# Altium schematic sheet foc.SchDoc
size A3; SheetNumber: 1; SheetTotal: 1
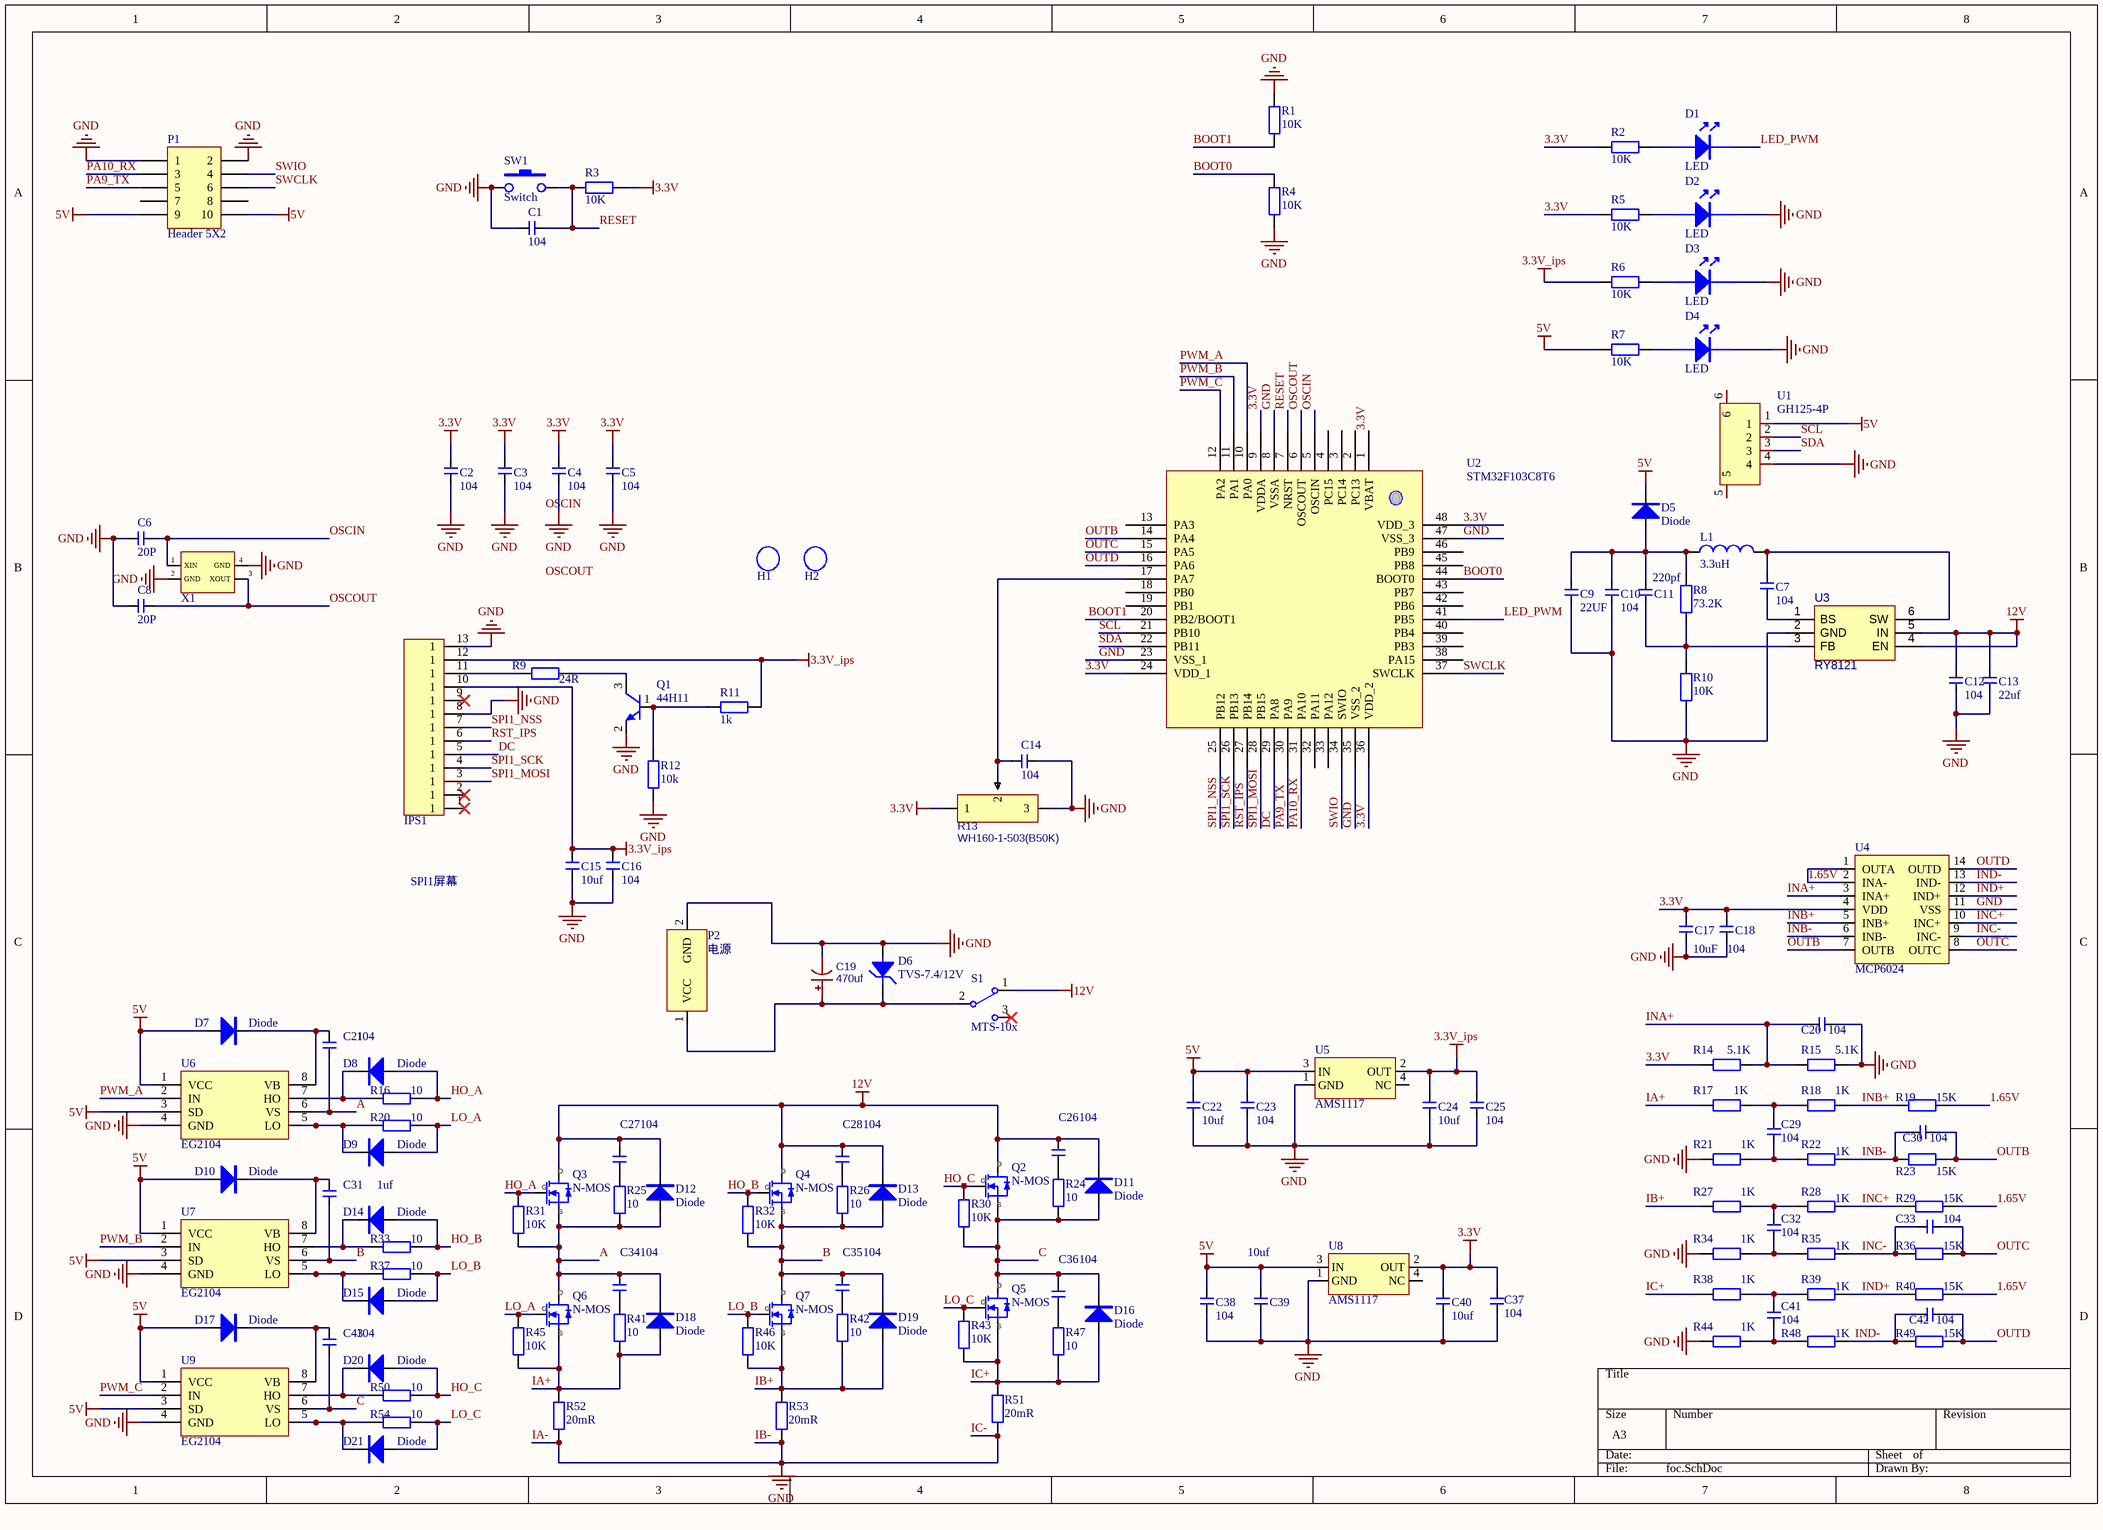
[diagram p0: foc.SchDoc]

## Parts
C1  104  [C0603]
C2  104  [C0603]
C3  104  [C0603]
C4  104  [C0603]
C5  104  [C0603]
C6  20P  [C0603]
C7  104  [C0603]
C8  20P  [C0603]
C9  22UF  [C0603]
C10  104  [C0603]
C11  220pf  [C0603]
C12  104  [C0603]
C13  22uf  [C0603]
C14  104  [C0603]
C15  10uf  [C0603]
C16  104  [C0603]
C17  10uF  [C0603]
C18  104  [C0603]
C19  470uf  [CAP-SMD_BD6.3-L6.6-W6.6-LS7.2-R-RD]
C20  104  [C0603]
C21  104  [C0603]
C22  10uf  [C0603]
C23  104  [C0603]
C24  10uf  [C0603]
C25  104  [C0603]
C26  104  [C0603]
C27  104  [C0603]
C28  104  [C0603]
C29  104  [C0603]
C30  104  [C0603]
C31  1uf  [C0603]
C32  104  [C0603]
C33  104  [C0603]
C34  104  [C0603]
C35  104  [C0603]
C36  104  [C0603]
C37  104  [C0603]
C38  104  [C0603]
C39  10uf  [C0603]
C40  10uf  [C0603]
C41  104  [C0603]
C42  104  [C0603]
C43  104  [C0603]
D1  LED  [LED0603]
D2  LED  [LED0603]
D3  LED  [LED0603]
D4  LED  [LED0603]
D5  Diode  [SOD-123FL_L2.7-W1.8-LS3.8-RD]
D6  TVS-7.4/12V  [SMA]
D7  Diode  [SOD-123FL_L2.7-W1.8-LS3.8-RD]
D8  Diode  [ESC_L1.2-W0.8-LS1.6-RD]
D9  Diode  [ESC_L1.2-W0.8-LS1.6-RD]
D10  Diode  [SOD-123FL_L2.7-W1.8-LS3.8-RD]
D11  Diode  [SOD-123FL_L2.7-W1.8-LS3.8-RD]
D12  Diode  [SOD-123FL_L2.7-W1.8-LS3.8-RD]
D13  Diode  [SOD-123FL_L2.7-W1.8-LS3.8-RD]
D14  Diode  [ESC_L1.2-W0.8-LS1.6-RD]
D15  Diode  [ESC_L1.2-W0.8-LS1.6-RD]
D16  Diode  [SOD-123FL_L2.7-W1.8-LS3.8-RD]
D17  Diode  [SOD-123FL_L2.7-W1.8-LS3.8-RD]
D18  Diode  [SOD-123FL_L2.7-W1.8-LS3.8-RD]
D19  Diode  [SOD-123FL_L2.7-W1.8-LS3.8-RD]
D20  Diode  [ESC_L1.2-W0.8-LS1.6-RD]
D21  Diode  [ESC_L1.2-W0.8-LS1.6-RD]
H1  Hole  [铜柱孔3]  (value not drawn)
H2  Hole  [铜柱孔3]  (value not drawn)
IPS1  IPS1.14  [IPS]  (value not drawn)
L1  3.3uH  [0402 TPC 4*4*2]
P1  Header 5X2  [HDR2X5]
P2  电源  [POWER]
Q1  44H11  [SOT-23-3_L2.9-W1.3-P1.90-LS2.4-BR]
Q2  N-MOS  [TDSON-8]
Q3  N-MOS  [TDSON-8]
Q4  N-MOS  [TDSON-8]
Q5  N-MOS  [TDSON-8]
Q6  N-MOS  [TDSON-8]
Q7  N-MOS  [TDSON-8]
R1  10K  [R0603]
R2  10K  [R0603]
R3  10K  [R0603]
R4  10K  [R0603]
R5  10K  [R0603]
R6  10K  [R0603]
R7  10K  [R0603]
R8  73.2K  [R0603]
R9  24R  [R0603]
R10  10K  [R0603]
R11  1k  [R0603]
R12  10k  [R0603]
R13  WH160-1-503(B50K)  [滑动变阻器]
R14  5.1K  [R0603]
R15  5.1K  [R0603]
R16  10  [R0603]
R17  1K  [R0603]
R18  1K  [R0603]
R19  15K  [R0603]
R20  10  [R0603]
R21  1K  [R0603]
R22  1K  [R0603]
R23  15K  [R0603]
R24  10  [R0603]
R25  10  [R0603]
R26  10  [R0603]
R27  1K  [R0603]
R28  1K  [R0603]
R29  15K  [R0603]
R30  10K  [R0603]
R31  10K  [R0603]
R32  10K  [R0603]
R33  10  [R0603]
R34  1K  [R0603]
R35  1K  [R0603]
R36  15K  [R0603]
R37  10  [R0603]
R38  1K  [R0603]
R39  1K  [R0603]
R40  15K  [R0603]
R41  10  [R0603]
R42  10  [R0603]
R43  10K  [R0603]
R44  1K  [R0603]
R45  10K  [R0603]
R46  10K  [R0603]
R47  10  [R0603]
R48  1K  [R0603]
R49  15K  [R0603]
R50  10  [R0603]
R51  20mR  [R1206]
R52  20mR  [R1206]
R53  20mR  [R1206]
R54  10  [R0603]
S1  MTS-10x  [SW-TH_HOOYA_SS-12D10G4]
SW1  Switch  [SW-SMD_L4.0-W2.9-LS5.0]
U1  GH125-4P  [CONN-SMD_4P-P1.27_GH125-S04DCA-00]
U2  STM32F103C8T6  [48P]
U3  RY8121  [SOT-23-6]
U4  MCP6024  [SOP14_L]
U5  AMS1117  [SOT-89_L4.5-W2.5-P1.50-LS4.2-BR]
U6  EG2104  [SOP-8]
U7  EG2104  [SOP-8]
U8  AMS1117  [SOT-89_L4.5-W2.5-P1.50-LS4.2-BR]
U9  EG2104  [SOP-8]
X1  XTAL-4  [OSC-SMD_4P-L3.2-W2.5-BL]  (value not drawn)

## Nets
3.3V: C2.2 C3.2 C4.2 C5.2 C17.1 C18.1 C37.2 C40.2 R2.1 R3.1 R5.1 R13.1 R14.2 U2.1(VBAT) U2.9(VDDA) U2.24(VDD_1) U2.36(VDD_2) U2.48(VDD_3) U4.4(VDD) U8.2(OUT)
3.3V_ips: C15.2 C16.2 C24.2 C25.2 IPS1.10(1) IPS1.12(1) R6.1 R11.1 U5.2(OUT)
5V: C22.2 C23.2 C38.2 C39.2 D5.1 D7.2 D10.2 D17.2 P1.9 P1.10 R7.1 U1.1 U5.3(IN) U6.1(VCC) U6.3(SD) U7.1(VCC) U7.3(SD) U8.3(IN) U9.1(VCC) U9.3(SD)
12V: C12.2 C13.2 C26.2 C27.2 C28.2 D11.1 D12.1 D13.1 Q2.1(D) Q3.1(D) Q4.1(D) S1.1 U3.4(EN) U3.5(IN)
GND: C1.2 C2.1 C3.1 C4.1 C5.1 C6.2 C8.2 C9.1 C10.1 C12.1 C13.1 C14.1 C15.1 C16.1 C17.2 C18.2 C19.2 C20.1 C22.1 C23.1 C24.1 C25.1 C37.1 C38.1 C39.1 C40.1 D2.N D3.N D4.N D6.A IPS1.8(1) IPS1.13(1) P1.1 P1.2 P2.2(GND) Q1.2(E) R1.1 R4.2 R10.1 R12.2 R13.3 R15.1 R21.2 R34.2 R44.2 R51.1 R52.1 R53.1 SW1.1 U1.4 U2.8(VSSA) U2.23(VSS_1) U2.35(VSS_2) U2.47(VSS_3) U3.2(GND) U4.11(VSS) U5.1(GND) U6.4(GND) U7.4(GND) U8.1(GND) U9.4(GND) X1.2(GND) X1.4(GND)  [also labelled IA-, IB-, IC-]
1.65V: R19.1 R29.1 R40.1 U4.1(OUTA) U4.2(INA-)
A: C21.1 C34.2 D12.2 D18.1 Q3.3(S) Q6.1(D) R25.2 R31.1 U6.6(VS)
B: C31.1 C35.2 D13.2 D19.1 Q4.3(S) Q7.1(D) R26.2 R32.1 U7.6(VS)
BOOT0: R4.1 U2.44(BOOT0)
BOOT1: R1.2 U2.20(PB2/BOOT1)
C: C36.2 C43.1 D11.2 D16.1 Q2.3(S) Q5.1(D) R24.2 R30.1 U9.6(VS)
DC: IPS1.5(1) U2.29(PA8)
HO_A: D8.2 Q3.2(G) R16.1 R31.2
HO_B: D14.2 Q4.2(G) R32.2 R33.1
HO_C: D20.2 Q2.2(G) R30.2 R50.1
IA+: D18.2 Q6.3(S) R17.2 R41.2 R45.1 R52.2
IB+: D19.2 Q7.3(S) R27.2 R42.2 R46.1 R53.2
IC+: D16.2 Q5.3(S) R38.2 R43.1 R47.2 R51.2
INA+: C20.2 R14.1 R15.2 U4.3(INA+)
INB+: R18.1 R19.2 U4.5(INB+)
INB-: C30.2 R22.1 R23.2 U4.6(INB-)
INC+: R28.1 R29.2 U4.10(INC+)
INC-: C33.2 R35.1 R36.2 U4.9(INC-)
IND+: R39.1 R40.2 U4.12(IND+)
IND-: C42.2 R48.1 R49.2 U4.13(IND-)
LED_PWM: D1.N U2.41(PB5)
LO_A: D9.2 Q6.2(G) R20.1 R45.2
LO_B: D15.2 Q7.2(G) R37.1 R46.2
LO_C: D21.2 Q5.2(G) R43.2 R54.1
OSCIN: C6.1 U2.5(OSCIN) X1.1(XIN)
OSCOUT: C8.1 U2.6(OSCOUT) X1.3(XOUT)
OUTB: C30.1 R23.1 U2.14(PA4) U4.7(OUTB)
OUTC: C33.1 R36.1 U2.15(PA5) U4.8(OUTC)
OUTD: C42.1 R49.1 U2.16(PA6) U4.14(OUTD)
PA9_TX: P1.5 U2.30(PA9)
PA10_RX: P1.3 U2.31(PA10)
PWM_A: U2.10(PA0) U6.2(IN)
PWM_B: U2.11(PA1) U7.2(IN)
PWM_C: U2.12(PA2) U9.2(IN)
RESET: C1.1 R3.2 SW1.2 U2.7(NRST)
RST_IPS: IPS1.6(1) U2.27(PB14)
SCL: U1.2 U2.21(PB10)
SDA: U1.3 U2.22(PB11)
SPI1_MOSI: IPS1.3(1) U2.28(PB15)
SPI1_NSS: IPS1.7(1) U2.25(PB12)
SPI1_SCK: IPS1.4(1) U2.26(PB13)
SWCLK: P1.6 U2.37(SWCLK)
SWIO: P1.4 U2.34(SWIO)
NetC7_1: C7.1 U3.1(BS)
NetC7_2: C7.2 L1.2 U3.6(SW)
NetC9_2: C9.2 C10.2 C11.2 D5.2 L1.1 R8.2
NetC11_1: C11.1 R8.1 R10.2 U3.3(FB)
NetC14_2: C14.2 R13.2 U2.17(PA7)
NetC19_1: C19.1 D6.N P2.1(VCC) S1.2
NetC21_2: C21.2 D7.1 U6.8(VB)
NetC26_1: C26.1 R24.1
NetC27_1: C27.1 R25.1
NetC28_1: C28.1 R26.1
NetC29_1: C29.1 R17.1 R18.2
NetC29_2: C29.2 R21.1 R22.2
NetC31_2: C31.2 D10.1 U7.8(VB)
NetC32_1: C32.1 R34.1 R35.2
NetC32_2: C32.2 R27.1 R28.2
NetC34_1: C34.1 R41.1
NetC35_1: C35.1 R42.1
NetC36_1: C36.1 R47.1
NetC41_1: C41.1 R44.1 R48.2
NetC41_2: C41.2 R38.1 R39.2
NetC43_2: C43.2 D17.1 U9.8(VB)
NetD1_A: D1.A R2.2
NetD2_A: D2.A R5.2
NetD3_A: D3.A R6.2
NetD4_A: D4.A R7.2
NetD8_1: D8.1 R16.2 U6.7(HO)
NetD9_1: D9.1 R20.2 U6.5(LO)
NetD14_1: D14.1 R33.2 U7.7(HO)
NetD15_1: D15.1 R37.2 U7.5(LO)
NetD20_1: D20.1 R50.2 U9.7(HO)
NetD21_1: D21.1 R54.2 U9.5(LO)
NetIPS1_11: IPS1.11(1) R9.2
NetQ1_1: Q1.1(B) R11.2 R12.1
NetQ1_3: Q1.3(C) R9.1

Not connected (* = marked no-connect by the designer): IPS1 1* 2(1)* 9(1)*; P1 7 8; S1 3*; U1 5 6; U2 2(PC13) 3(PC14) 4(PC15) 13(PA3) 18(PB0) 19(PB1) 32(PA11) 33(PA12) 38(PA15) 39(PB3) 40(PB4) 42(PB6) 43(PB7) 45(PB8) 46(PB9); U5 4(NC); U8 4(NC)

## Notes on the sheet
- SPI1屏幕
- Labels drawn without touching a wire or pin: OSCIN, OSCOUT

## Library data of the parts
C1-C18 C20-C43 = C: 无极性电容; BOM名称: 无极性贴片电容; 版权归属: 源创客; 学习资源: www.ooocke.com
C19 = CAP+: 电解电容 10uf  贴片型 钽电容的正极是实物有线的一段; BOM_Manufacturer: ROQANG; BOM_Manufacturer Part: RVT1V100M0405; nameAlias: Capacitance; BOM_Supplier: LCSC; BOM_Supplier Part: C72485; BOM_JLCPCB Part Class: Extended Part; spicePre: C; spiceSymbolName: RVT1V100M0405-C72485
D5 D7-D21 = 二极管: Diode 1N series
H1 H2 = Hole: 电机的洞
L1 = L: 电感; BOM名称: 小功率贴片电感; 版权归属: 源创客; 学习资源: www.ooocke.com
P1 = Header 5X2: Header, 5-Pin, Dual row; LatestRevisionDate: 17-Jul-2002; LatestRevisionNote: Re-released for DXP Platform.; Publisher: Altium Limited
P2 = power
Q1 = NPN: NPN型; BOM名称: 互补功率-NPN型; 版权归属: 源创客; 属性: 80V 8A 50W; 学习资源: www.ooocke.com
Q2-Q7 = N-MOS: N沟场效应管; 版权归属: 源创客; BOM名称: N沟场效应管; 学习资源: www.ooocke.com
R1-R12 R14-R54 = R: 电阻; BOM名称: 贴片电阻; 版权归属: 源创客; 学习资源: www.ooocke.com
R13 = WH160-1-503(B50K): 拨码开关; Manufacturer: JML; nameAlias: Value; Supplier: LCSC; Manufacturer Part: WH160-1-503(B50K); Supplier Part: C52954; spicePre: R; spiceSymbolName: B503，可变电阻
S1 = MTS-10x: MTS10x系列3脚扭子开关; 版权归属: 源创客; BOM名称: MTS10x系列3脚扭子开关; 学习资源: www.ooocke.com
U3 = RY8121: 18V 2A 1MHz Synchronous Step-Down Regulator
X1 = XTAL-4: 贴片晶振